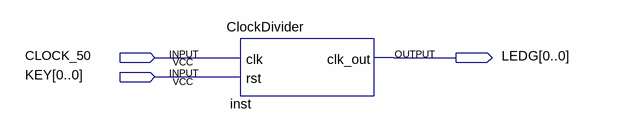
[diagram p0: schematic sheet]
// Quartus schematic Block_ClockDivider.bdf as structural Verilog: 1 symbols, 3 pins
module Block_ClockDivider (
  input  CLOCK_50,
  input  [0:0] KEY,
  output [0:0] LEDG
);

  ClockDivider inst (.clk(CLOCK_50), .rst(KEY[0]), .clk_out(LEDG[0]));
endmodule
